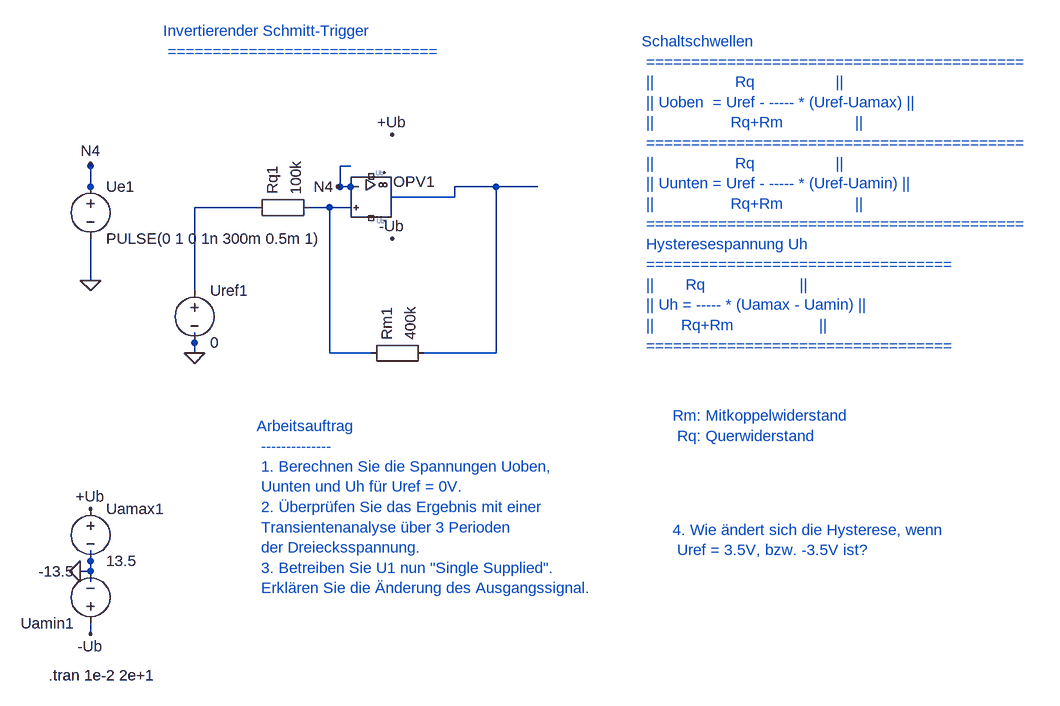
[diagram p0: schematic 2_2_2_invertierender_Schmitt-Trigger.asc]
2_2_2_invertierender_Schmitt-Trigger.asc, the LTspice schematic file:
Version 4
SHEET 1 880 680
WIRE 528 320 512 320
WIRE 512 320 512 288
WIRE 512 288 528 288
WIRE 592 336 688 336
WIRE 688 336 688 320
WIRE 128 896 128 880
WIRE 288 560 288 544
WIRE 128 400 128 416
WIRE 128 912 128 928
WIRE 288 576 288 544
WIRE 128 464 128 416
WIRE 688 320 752 320
WIRE 528 352 496 352
WIRE 384 352 288 352
WIRE 288 352 288 480
WIRE 496 352 464 352
WIRE 560 576 496 576
WIRE 496 576 496 352
WIRE 128 288 128 320
WIRE 112 912 128 912
WIRE 752 320 752 576
WIRE 752 576 640 576
WIRE 816 320 752 320
WIRE 128 912 128 880
WIRE 128 992 128 1008
WIRE 528 320 508 320
WIRE 128 320 128 284
FLAG 112 912 0
FLAG 288 576 0
FLAG 128 464 0
FLAG 112 912 0
FLAG 288 576 0
FLAG 128 464 0
FLAG 508 320 N4
FLAG 128 284 N4
FLAG 128 816 +Ub
FLAG 592 240 +Ub
FLAG 128 1008 -Ub
FLAG 592 400 -Ub
SYMBOL UniversalOpAmp2 560 336 R0
SYMATTR InstName OPV1
SYMATTR Value UniversalOpAmp2
SYMBOL voltage 128 800 R0
SYMATTR InstName Uamax1
SYMATTR Value 13.5
SYMBOL Misc\EuropeanResistor 544 592 R270
SYMATTR InstName Rm1
SYMATTR Value 400k
SYMBOL Misc\EuropeanResistor 368 368 R270
SYMATTR InstName Rq1
SYMATTR Value 100k
SYMBOL voltage 288 464 R0
SYMATTR InstName Uref1
SYMATTR Value 0
SYMBOL voltage 128 304 R0
SYMATTR InstName Ue1
SYMATTR Value PULSE(0 1 0 1n 300m 0.5m 1)
SYMBOL voltage 128 1008 R180
SYMATTR InstName Uamin1
SYMATTR Value -13.5
TEXT 64 1072 Left 2 !.tran 1e-2 2e+1
TEXT 240 80 Left 2 ;Invertierender Schmitt-Trigger \n ==============================
TEXT 976 96 Left 2 ;Schaltschwellen \n ========================================== \n ||                  Rq                  || \n || Uoben  = Uref - ----- * (Uref-Uamax) || \n ||                 Rq+Rm                || \n ========================================== \n ||                  Rq                  || \n || Uunten = Uref - ----- * (Uref-Uamin) || \n ||                 Rq+Rm                || \n ========================================== \n Hysteresespannung Uh \n ================================== \n ||       Rq                     || \n || Uh = ----- * (Uamax - Uamin) || \n ||      Rq+Rm                   || \n ==================================
TEXT 384 688 Left 2 ;Arbeitsauftrag \n -------------- \n 1. Berechnen Sie die Spannungen Uoben, \n Uunten und Uh für Uref = 0V. \n 2. Überprüfen Sie das Ergebnis mit einer \n Transientenanalyse über 3 Perioden \n der Dreiecksspannung. \n 3. Betreiben Sie U1 nun "Single Supplied". \n Erklären Sie die Änderung des Ausgangssignal.
TEXT 1024 848 Left 2 ;4. Wie ändert sich die Hysterese, wenn \n Uref = 3.5V, bzw. -3.5V ist?
TEXT 1024 672 Left 2 ;Rm: Mitkoppelwiderstand \n Rq: Querwiderstand

The netlist it stands for:
* 2_2_2_invertierender_Schmitt-Trigger.asc
XOPV1 N002 N4 NC_01 NC_02 N001 level2 UniversalOpAmp2 Avol=1Meg GBW=10Meg Slew=10Meg Ilimit=25m Rail=0 Vos=0 En=0 Enk=0 In=0 Ink=0 Rin=500Meg  ; pins In+ In- V+ V- OUT
V§Uamax1 +Ub 0 13.5
Rm1 N002 N001 400k
Rq1 N003 N002 100k
V§Uref1 N003 0 0
V§Ue1 N4 0 PULSE(0 1 0 1n 300m 0.5m 1)
V§Uamin1 -Ub 0 -13.5
.tran 1e-2 2e+1
* Invertierender Schmitt-Trigger
*  ==============================
* Schaltschwellen
*  ==========================================
*  ||                  Rq                  ||
*  || Uoben  = Uref - ----- * (Uref-Uamax) ||
*  ||                 Rq+Rm                ||
*  ==========================================
*  ||                  Rq                  ||
*  || Uunten = Uref - ----- * (Uref-Uamin) ||
*  ||                 Rq+Rm                ||
*  ==========================================
*  Hysteresespannung Uh
*  ==================================
*  ||       Rq                     ||
*  || Uh = ----- * (Uamax - Uamin) ||
*  ||      Rq+Rm                   ||
*  ==================================
* Arbeitsauftrag
*  --------------
*  1. Berechnen Sie die Spannungen Uoben,
*  Uunten und Uh für Uref = 0V.
*  2. Überprüfen Sie das Ergebnis mit einer
*  Transientenanalyse über 3 Perioden
*  der Dreiecksspannung.
*  3. Betreiben Sie U1 nun "Single Supplied".
*  Erklären Sie die Änderung des Ausgangssignal.
* 4. Wie ändert sich die Hysterese, wenn
*  Uref = 3.5V, bzw. -3.5V ist?
* Rm: Mitkoppelwiderstand
*  Rq: Querwiderstand
.lib UniversalOpAmp2.lib
.backanno
.end